# Altium schematic sheet PWM.SchDoc
size A3
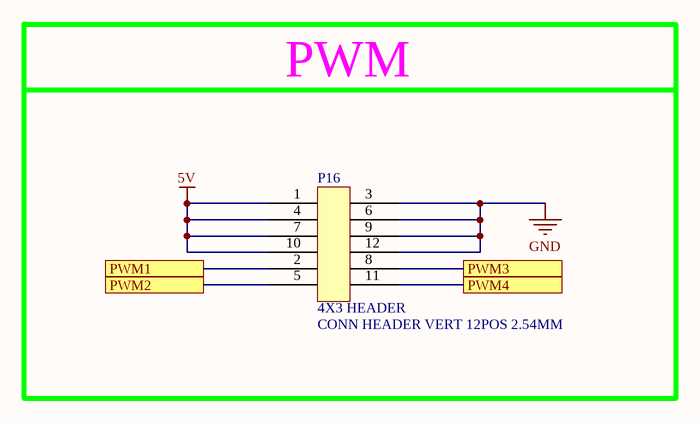
[diagram p0: PWM.SchDoc]

## Parts
P16  CONN HEADER VERT 12POS 2.54MM  [TSW-104-23-L-T]

## Blocks framed on the sheet
PWM: P16

## Ports
PWM1, PWM2, PWM3, PWM4

## Nets
5V: P16.1 P16.4 P16.7 P16.10
GND: P16.3 P16.6 P16.9 P16.12
PWM1: P16.2 ; port PWM1
PWM2: P16.5 ; port PWM2
PWM3: P16.8 ; port PWM3
PWM4: P16.11 ; port PWM4

## Notes on the sheet
- (in symbol TSW-104-23-L-T) 4X3 HEADER

## Library data of the parts
P16 = TSW-104-23-L-T